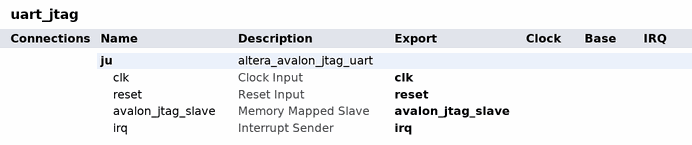
[diagram p0: system contents]
# Platform Designer (Qsys) system uart_jtag, Cyclone IV E EP4CE22F17C8
# Parameters at their usual value, and those the tool derives, are not listed.
package require -exact qsys 20.1
create_system uart_jtag
set_project_property DEVICE_FAMILY {Cyclone IV E}
set_project_property DEVICE EP4CE22F17C8

add_instance ju altera_avalon_jtag_uart 20.1
set_instance_parameter_value ju simInteractiveOptions NO_INTERACTIVE_WINDOWS

# exported interfaces
add_interface avalon_jtag_slave avalon slave
set_interface_property avalon_jtag_slave EXPORT_OF ju.avalon_jtag_slave
add_interface clk clock sink
set_interface_property clk EXPORT_OF ju.clk
add_interface irq interrupt sender
set_interface_property irq EXPORT_OF ju.irq
add_interface reset reset sink
set_interface_property reset EXPORT_OF ju.reset

set_interconnect_requirement {$system} qsys_mm.clockCrossingAdapter HANDSHAKE
set_interconnect_requirement {$system} qsys_mm.enableEccProtection FALSE
set_interconnect_requirement {$system} qsys_mm.insertDefaultSlave FALSE
set_interconnect_requirement {$system} qsys_mm.maxAdditionalLatency 1

save_system uart_jtag.qsys
